# EAGLE design LPC824DIP (EAGLE 7.3.0)
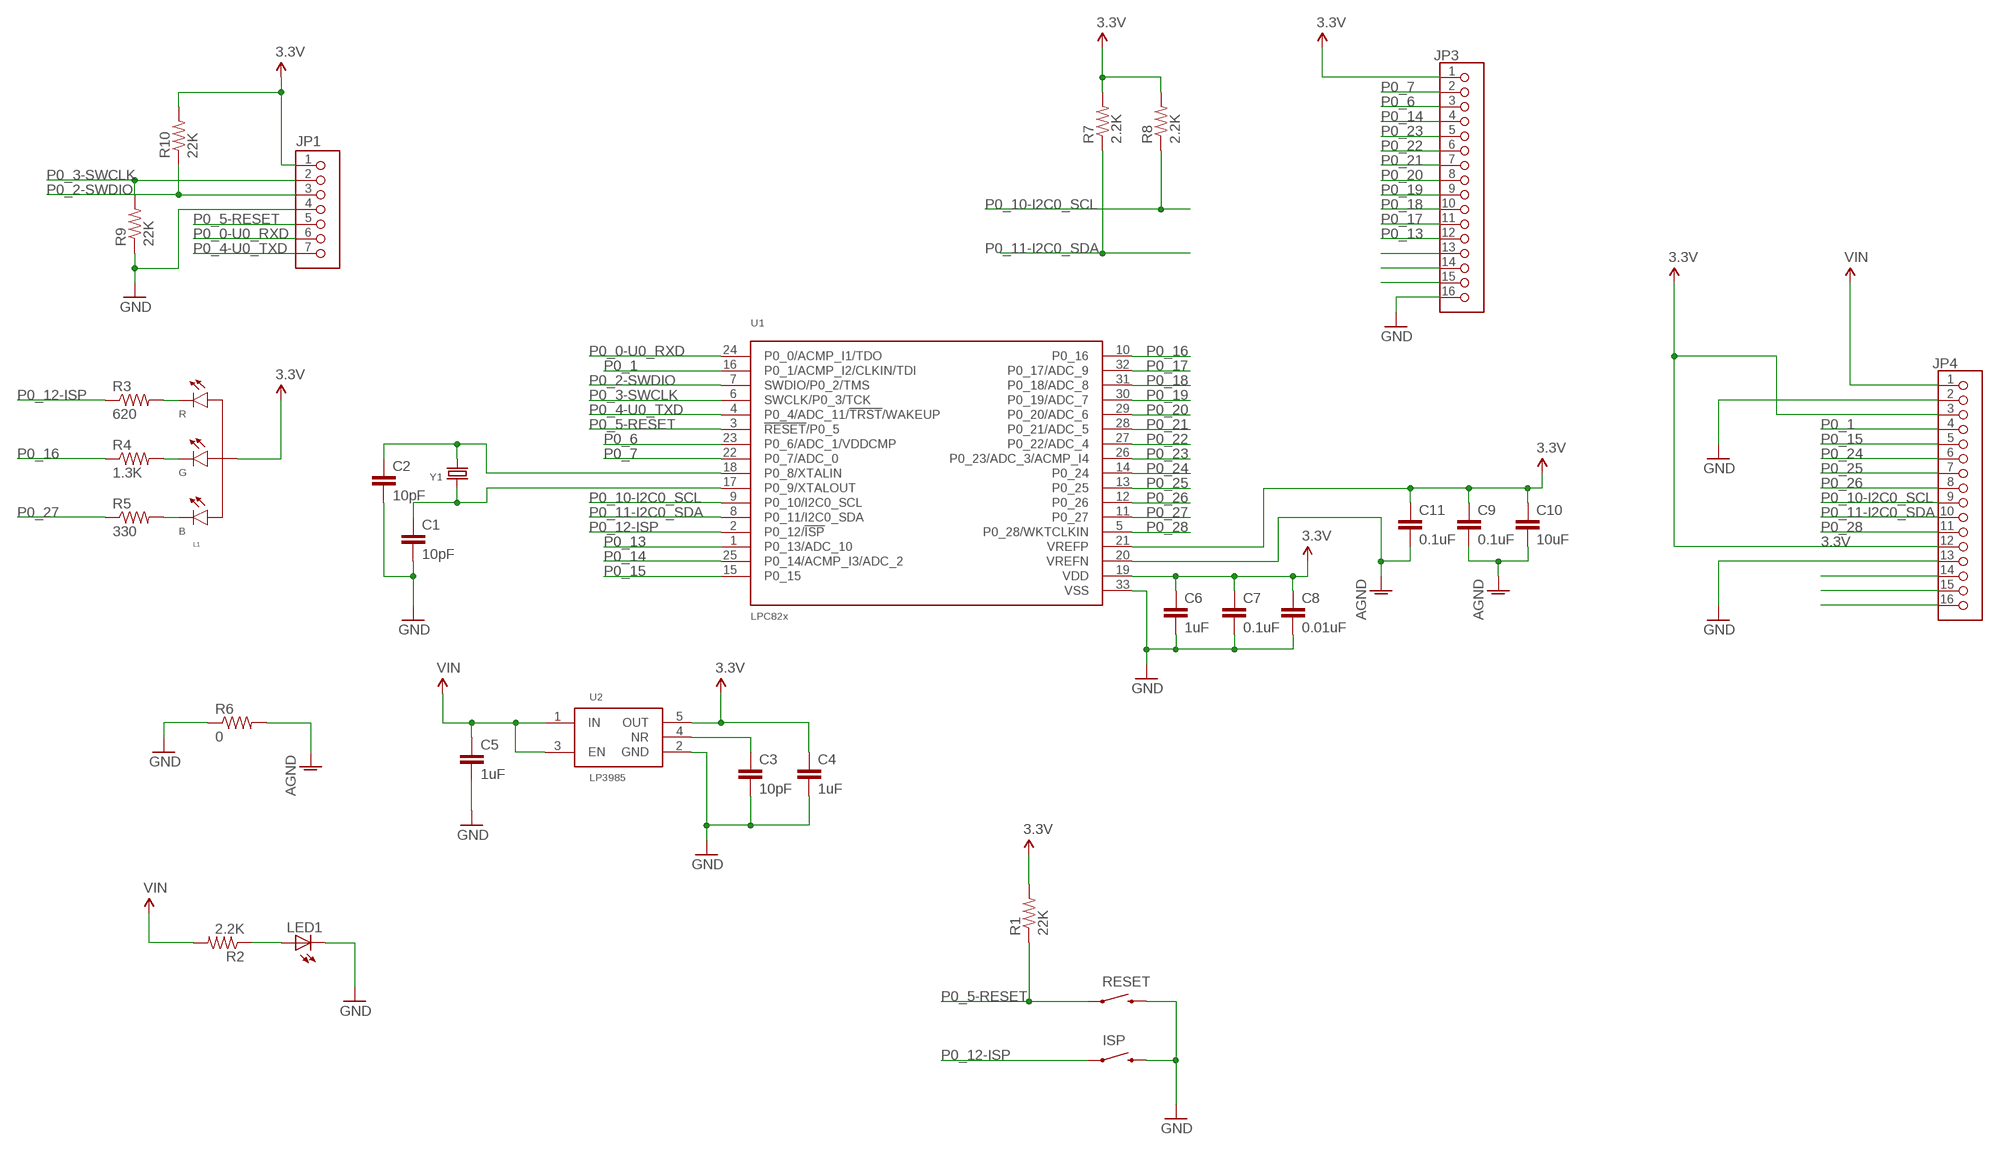
[diagram p0: schematic, sheet 1]

## Parts
C1  10pF  C0402  [C0402]
C2  10pF  C0402  [C0402]
C3  10pF  C0402  [C0402]
C4  1uF  C0402  [C0402]
C5  1uF  C0402  [C0402]
C6  1uF  C0402  [C0402]
C7  0.1uF  C0402  [C0402]
C8  0.01uF  C0402  [C0402]
C9  0.1uF  C0402  [C0402]
C10  10uF  C0402  [C0402]
C11  0.1uF  C0402  [C0402]
ISP  KMR221GLFS  [TACTILE_SWITCH_SMD-3]
JP1  HEADER_1X7_JST-SH_VERTICAL  [JST-SH_HEADER_VERTICAL_7]
JP3  HEADER_1X16  [HEADER_100MIL_1X16]
JP4  HEADER_1X16  [HEADER_100MIL_1X16]
L1  LED_RGB_CA-CLVBA-FKA  [P-LCC4-0]
LED1  LEDCHIPLED_0603  [CHIPLED_0603]
R1  22K  R0402  [R0402]
R2  2.2K  R0402  [R0402]
R3  620  R0402  [R0402]
R4  1.3K  R0402  [R0402]
R5  330  R0402  [R0402]
R6  0  R0402  [R0402]
R7  2.2K  R0402  [R0402]
R8  2.2K  R0402  [R0402]
R9  22K  R0402  [R0402]
R10  22K  R0402  [R0402]
RESET  KMR221GLFS  [TACTILE_SWITCH_SMD-3]
U1  LPC82XMX01JHI33  [QFN33]
U2  LP3985DBV  [SOT23]
Y1  CRYSTAL_3.2X2.5_4PAD  [CRYSTAL_SMD_3.2X2.5_4PAD]

## Nets
3.3V: C4.1 C6.1 C7.1 C8.1 C9.1 C10.1 C11.1 JP1.1 JP3.1 JP4.3 JP4.12 L1.2(A) R1.2 R7.2 R8.2 R10.2 U1.19(VDD) U1.21(VREFP) U2.5(OUT)
AGND: C9.2 C10.2 C11.2 R6.2 U1.20(VREFN)
GND: C1.2 C2.2 C3.2 C4.2 C5.2 C6.2 C7.2 C8.2 ISP.3 ISP.4 JP1.4 JP3.16 JP4.2 JP4.13 LED1.C R6.1 R9.1 RESET.3 RESET.4 U1.33(VSS) U2.2(GND)
N$1: C2.1 U1.18(P0_8/XTALIN) Y1.3
N$2: C1.1 U1.17(P0_9/XTALOUT) Y1.1
N$3: C3.1 U2.4(NR)
N$4: L1.1(RK) R3.2
N$15: LED1.A R2.1
N$23: L1.4(GK) R4.2
N$24: L1.3(BK) R5.2
P0_0-U0_RXD: JP1.6 JP3.14 U1.24(P0_0/ACMP_I1/TDO)
P0_1: JP4.4 U1.16(P0_1/ACMP_I2/CLKIN/TDI)
P0_2-SWDIO: JP1.3 R10.1 U1.7(SWDIO/P0_2/TMS)
P0_3-SWCLK: JP1.2 R9.2 U1.6(SWCLK/P0_3/TCK)
P0_4-U0_TXD: JP1.7 JP3.13 U1.4(P0_4/ADC_11/!TRST!/WAKEUP)
P0_5-RESET: JP1.5 JP4.14 R1.1 RESET.1 RESET.2 U1.3(!RESET!/P0_5)
P0_6: JP3.3 U1.23(P0_6/ADC_1/VDDCMP)
P0_7: JP3.2 U1.22(P0_7/ADC_0)
P0_10-I2C0_SCL: JP4.9 R8.1 U1.9(P0_10/I2C0_SCL)
P0_11-I2C0_SDA: JP4.10 R7.1 U1.8(P0_11/I2C0_SDA)
P0_12-ISP: ISP.1 ISP.2 JP3.15 R3.1 U1.2(P0_12/!ISP!)
P0_13: JP3.12 U1.1(P0_13/ADC_10)
P0_14: JP3.4 U1.25(P0_14/ACMP_I3/ADC_2)
P0_15: JP4.5 U1.15(P0_15)
P0_16: JP4.16 R4.1 U1.10(P0_16)
P0_17: JP3.11 U1.32(P0_17/ADC_9)
P0_18: JP3.10 U1.31(P0_18/ADC_8)
P0_19: JP3.9 U1.30(P0_19/ADC_7)
P0_20: JP3.8 U1.29(P0_20/ADC_6)
P0_21: JP3.7 U1.28(P0_21/ADC_5)
P0_22: JP3.6 U1.27(P0_22/ADC_4)
P0_23: JP3.5 U1.26(P0_23/ADC_3/ACMP_I4)
P0_24: JP4.6 U1.14(P0_24)
P0_25: JP4.7 U1.13(P0_25)
P0_26: JP4.8 U1.12(P0_26)
P0_27: JP4.15 R5.1 U1.11(P0_27)
P0_28: JP4.11 U1.5(P0_28/WKTCLKIN)
VIN: C5.1 JP4.1 R2.2 U2.1(IN) U2.3(EN)

## Library data of the parts
C1-C11 = heck:C
ISP RESET = heck:KMR221
JP1 = heck:HEADER_1X7
JP3 JP4 = heck:HEADER_1X16
L1 = heck:LED_RGB_CA: Cree: CLVBA-FKA
LED1 = adafruit:LED: LED OSRAM: - CHIPLED LG R971, LG N971, LY N971, LG Q971, LY Q971, LO R971, LY R971 LH N974, LH R974 LS Q976, LO Q976, LY Q976 LO Q996 - Hyper CHIPLED LW Q18S LB Q993, LB Q99A, LB R99A - SideLED LS A670, LO A670, LY A670, LG A670, LP A670 LB A673, LV A673, LT A673, LW A673 LH A674 LY A675 LS A676, LA A676, LO A676, LY A676, LW A676 LS A679, LY A679, LG A679 - Hyper Micro SIDELED® LS Y876, LA Y876, LO Y876, LY Y876 LT Y87S - SmartLED LW L88C, LW L88S LB L89C, LB L89S, LG L890 LS L89K, LO L89K, LY L89K LS L896, LA L896, LO L896, LY L896 - TOPLED LS T670, LO T670, LY T670, LG T670, LP T670 LSG T670, LSP T670, LSY T670, LOP T670, LYG T670 LG T671, LOG T671, LSG T671 LB T673, LV T673, LT T673, LW T673 LH T674 LS T676, LA T676, LO T676, LY T676, LB T676, LH T676, LSB T676, LW T676 LB T67C, LV T67C, LT T67C, LS T67K, LO T67K, LY T67K, LW E67C LS E67B, LA E67B, LO E67B, LY E67B, LB E67C, LV E67C, LT E67C LW T67C LS T679, LY T679, LG T679 LS T770, LO T770, LY T770, LG T770, LP T770 LB T773, LV T773, LT T773, LW T773 LH T774 LS E675, LA E675, LY E675, LS T675 LS T776, LA T776, LO T776, LY T776, LB T776 LHGB T686 LT T68C, LB T68C - Hyper Mini TOPLED® LB M676 - Mini TOPLED Santana® LG M470 LS M47K, LO M47K, LY M47K Source: http://www.osram.convergy.de/
R1-R10 = heck:R
U1 = heck:LPC82XMX01JHI33: LPC824M201JHI33 - 32KB flash, 8KB SRAM LPC822M101JHI33 - 16KB flash, 4KB SRAM
U2 = heck:LP3985: Ultra Low-Dropout CMOS Voltage regulator. 150mA Load, available in fixed voltages: 2.5-V, 2.6-V, 2.7-V, 2.8-V, 2.85-V, 2.9-V, 3-V, 3.1V, 3.2-V, 3.3-V, 4.7-V, 4.75-V, 4.8-V and 5-V
Y1 = heck:CRYSTAL

## Board
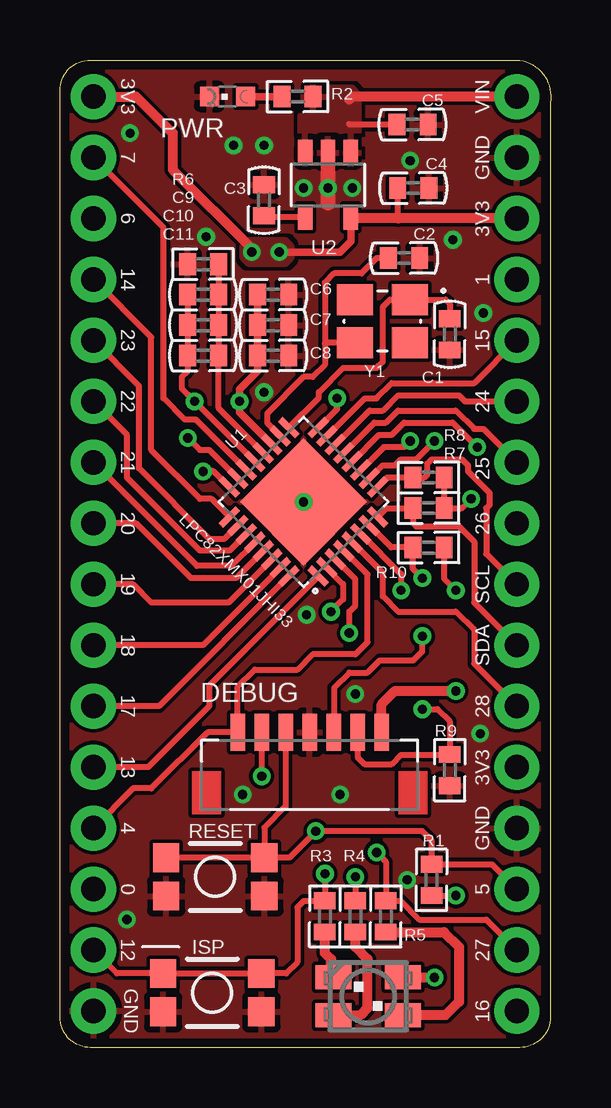
[diagram p1: board, top side]
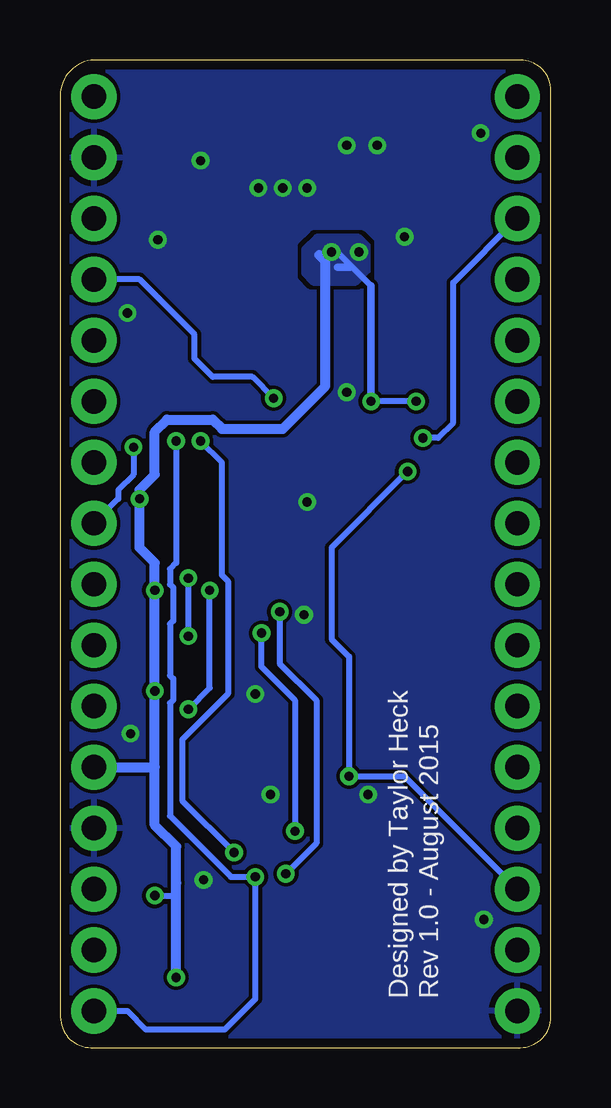
[diagram p2: board, bottom side, seen from below]

Size 20.47 x 41.15 mm. Coordinates in mm from the lower left corner, seen from the top.
Outline: 0,1.27 0,39.88 arc-90 1.27,41.15 19.18,41.15 arc-90 20.45,39.37 20.45,1.27 arc-90 19.18,0 1.27,0 arc-90 0,1.27
Copper layers (1*16): Top 0.0356mm / dielectric 1.5011mm / Bottom 0.0356mm
Design rules "heck *": minimum track width 6mil, minimum drill 13mil, track to track 6mil, track to pad 6mil, pad to pad 6mil, via to via 6mil, smd to smd 6mil, copper to edge 15mil, drill to drill 6mil, minimum pad ring 7mil, minimum via ring 7mil, stop-mask expansion 3mil, vias tented up to drill 20mil, thermal gap 10mil

### Footprints (pad centres in the part's own frame; a part is rotated, then mirrored left to right if it is on the bottom)
C0402 = smd 0.7 x 0.9: 1 -0.65,0; 2 0.65,0
TACTILE_SWITCH_SMD-3 = smd 1.1 x 1.2: 1 -2.05,0.8; 2 2.05,0.8; 3 -2.05,-0.8; 4 2.05,-0.8
JST-SH_HEADER_VERTICAL_7 = smd 0.6 x 1.55: 1 -3,-1.325; 2 -2,-1.325; 3 -1,-1.325; 4 0,-1.325; 5 1,-1.325; 6 2,-1.325; 7 3,-1.325
HEADER_100MIL_1X16 = drill 1.016 pad 1.88: 1 -19.05,0; 2 -16.51,0; 3 -13.97,0; 4 -11.43,0; 5 -8.89,0; 6 -6.35,0; 7 -3.81,0; 8 -1.27,0; 9 1.27,0; 10 3.81,0; 11 6.35,0; 12 8.89,0; 13 11.43,0; 14 13.97,0; 15 16.51,0; 16 19.05,0
P-LCC4-0 = smd 1 x 1.5: 1 -0.787,-1.45; 2 -0.787,1.45; 3 0.787,1.45; 4 0.787,-1.45
CHIPLED_0603 = smd 0.8 x 0.8: A 0,-0.75; C 0,0.75
R0402 = smd 0.7 x 0.9: 1 -0.65,0; 2 0.65,0
QFN33 = smd 1 x 0.27: 1 -2.625,1.75; 2 -2.625,1.25; 3 -2.625,0.75; 4 -2.625,0.25; 5 -2.625,-0.25; 6 -2.625,-0.75; 7 -2.625,-1.25; 8 -2.625,-1.75; 17 2.625,-1.75; 18 2.625,-1.25; 19 2.625,-0.75; 20 2.625,-0.25; 21 2.625,0.25; 22 2.625,0.75; 23 2.625,1.25; 24 2.625,1.75 | smd 0.27 x 1: 9 -1.75,-2.625; 10 -1.25,-2.625; 11 -0.75,-2.625; 12 -0.25,-2.625; 13 0.25,-2.625; 14 0.75,-2.625; 15 1.25,-2.625; 16 1.75,-2.625; 25 1.75,2.625; 26 1.25,2.625; 27 0.75,2.625; 28 0.25,2.625; 29 -0.25,2.625; 30 -0.75,2.625; 31 -1.25,2.625; 32 -1.75,2.625 | smd 3.75 x 3.75: 33 0,0
SOT23 = smd 0.6 x 1.05: 1 -0.95,-1.35; 2 0,-1.35; 3 0.95,-1.35; 4 0.95,1.35; 5 -0.95,1.35
CRYSTAL_SMD_3.2X2.5_4PAD = smd 1.5 x 1.3: 1 -1.15,-0.9; 2 1.15,-0.9; 3 1.15,0.9; 4 -1.15,0.9

### Placement (x,y rotation side)
C1  16.26,29.72 270 top
C2  14.35,32.89 0 top
C3  8.51,35.31 90 top
C4  14.73,35.81 0 top
C5  14.7,38.46 0 top
C6  8.89,31.37 0 top
C7  8.89,30.1 0 top
C8  8.89,28.83 0 top
C9  5.97,31.37 0 top
C10  5.97,30.1 0 top
C11  5.97,28.83 0 top
ISP  6.35,2.29 0 top
JP1  10.41,11.81 180 top
JP3  1.4,20.57 270 top
JP4  19.05,20.57 270 top
L1  12.85,2.13 270 top
LED1  6.99,39.62 90 top
R1  15.49,6.99 270 top
R2  9.91,39.62 0 top
R3  11.05,5.46 270 top
R4  12.32,5.46 270 top
R5  13.59,5.46 270 top
R6  5.97,32.64 0 top
R7  15.37,22.48 0 top
R8  15.37,23.75 0 top
R9  16.26,11.56 90 top
R10  15.37,20.83 0 top
RESET  6.48,7.11 0 top
U1  10.16,22.73 135 top
U2  11.18,35.94 180 top
Y1  13.45,30.26 180 top

### Tracks (layer width: path | path; a pad name or v marks a point on that pad's centre or on a via)
3.3V  (via drill 0.38)
  Top 0.254: C9.1 C10.1 C11.1 5.32,28.18 5.08,27.94 5.08,27.46 v5.61,26.92 | U1.21 v5.62,26.92 v5.61,26.92 | v5.61,26.92 5.32,27.22 | R8.2 R7.2 16.76,22.48 v17.14,22.86 | C4.1 14.08,34.61 | 14.08,34.61 14.1,34.59 | R1.2 v16.51,6.33 | R10.2 16.02,19.54 v16.51,19.05 | 14.08,34.61 14.08,34.56 14.1,34.54
  Top 0.305: U1.19 7.49,26.46 v7.49,26.92 7.49,27.43 8.24,28.18 C8.1 C7.1 C6.1 | U2.5 12.13,33.59 11.68,33.15 v9.14,33.15
  Top 0.406: L1.2 v15.62,2.92 | v15.62,2.92 | JP4.3 14.1,34.54 12.17,34.54 U2.5 | JP3.1 3.17,39.62 4.7,38.1 4.7,36.58 8,33.27 v8,33.15 | JP1.1 13.41,14.3 13.97,14.86 v16.51,14.86
  Bottom 0.254: v5.61,26.92 v7.49,26.92 | v16.51,6.33 15.62,6.33 15.62,6.86 | 7.49,31.75 8.89,33.15 v9.14,33.15
  Bottom 0.305: 8.89,32.51 8.38,32.51 | 7.49,31.75 v7.49,26.92
  Bottom 0.406: v15.62,2.92 15.62,6.86 15.62,8.38 16.51,9.27 16.51,11.68 | 16.51,11.68 v16.51,14.86 v16.51,19.05 16.51,20.19 17.14,20.83 v17.14,22.86 17.14,23.24 16.51,23.88 16.51,25.65 16,26.16 14.1,26.16 13.72,25.78 11.18,25.78 9.4,27.56 9.4,32.77 9.65,33.02 | JP4.12 16.51,11.68
  pour Bottom: 8,33.78 9.78,33.78 10.29,33.27 10.29,32.26 9.91,31.88 8.13,31.88 7.62,32.38 7.62,33.4
  pour Top: 7.87,33.66 9.4,33.66 9.65,33.4 9.65,32.89 9.4,32.64 7.87,32.64 7.62,32.89 7.62,33.4
AGND
  Top 0.254: U1.20 6.62,26.63 C11.2 C10.2 C9.2 R6.2
GND  (via drill 0.38)
  Top 0.61: U2.2 v11.18,35.81 11.18,35.18
  other vias: 10.16,22.73 17.65,30.61 6.1,33.78 8.51,37.59 14.61,36.96 16.38,33.66 17.53,13.08 7.62,10.54 11.68,10.54 10.29,18.03 7.24,37.59 2.92,38.1 12.19,35.81 10.16,35.81 8.51,27.3 14.48,6.99 2.79,5.33 12.32,14.73
  pour Top (rank 6): 20.7,41.02 20.32,-0.13 0,0 0,41.02
  pour Bottom (rank 6): 20.7,41.02 20.32,-0.13 -0.13,-0.25 0,41.02
N$1
  Top 0.254: Y1.3 11.07,29.36 11.05,29.34 | U1.18 8.64,26.02 8.64,26.42 10.16,27.94 10.54,27.94 11.05,28.45 11.05,29.34 | C2.1 13.21,32.89 12.57,32.26 11.43,32.26 11.05,31.88 11.05,29.34
N$2
  Top 0.254: C1.1 16.26,30.99 16.08,31.16 Y1.1 13.76,31.16 13.46,30.86 13.46,28.57 13.21,28.32 11.81,28.32 10.79,27.3 10.79,27.08 U1.17
N$3
  Top 0.254: U2.4 8.89,34.59 8.57,34.59 | 8.57,34.59 | C3.1 8.57,34.59
N$4
  Top 0.406: L1.1 11.3,3.02 11.3,3.68 11.05,3.94 R3.2
N$15
  Top 0.305: LED1.A R2.1
N$23
  Top 0.406: L1.4 12.52,1.35 12.83,1.65 12.83,3.68 12.32,4.19 R4.2
N$24
  Top 0.406: R5.2 16.02,4.81 16.64,4.19 16.64,1.91 16.08,1.35 L1.3
P0_0-U0_RXD  (via drill 0.38)
  Top 0.254: U1.24 6.42,24 v5.97,24 | JP1.6 v8.41,11.3
  Bottom 0.254: v5.97,24 9.14,20.83 9.14,17.02 8.41,16.29 v8.41,11.3 6.1,11.3 JP3.14
P0_1  (via drill 0.38)
  Top 0.254: U1.16 11.56,26.61 v11.56,27.05
  Bottom 0.254: JP4.4 17.14,32 14.86,29.72 14.86,28.7 14.1,27.94 12.45,27.94 v11.56,27.05
P0_2-SWDIO  (via drill 0.38)
  Top 0.254: U1.7 13.82,20.84 14.72,20.84 R10.1 14.72,19.95 v15.11,19.56 | JP1.3 11.43,13.15 11.43,14.99 12.06,15.62 12.83,15.62 13.34,16.13 14.73,16.13 15.11,16.51 v15.11,17.14
  Bottom 0.254: v15.11,17.14 v15.11,19.56
P0_3-SWCLK  (via drill 0.38)
  Top 0.254: U1.6 14.22,19.73 v14.22,19.05 | JP1.2 12.41,12.1 12.7,11.81 13.84,11.81 14.22,12.19 16.24,12.19 R9.2 16.26,13.59 15.75,14.1 v15.11,14.1
  Bottom 0.254: v15.11,14.1 14.22,14.99 v14.22,19.05
P0_4-U0_TXD
  Top 0.254: U1.4 12.83,19.71 12.83,16.89 12.32,16.38 10.54,16.38 9.91,15.75 8.13,15.75 7.41,15.03 JP1.7 6.15,13.14 3.81,10.79 3.05,10.79 JP3.13
P0_5-RESET  (via drill 0.38)
  Top 0.254: RESET.2 RESET.1 | v12.06,17.27 12.06,18.16 12.32,18.41 12.32,19.51 U1.3 | JP1.5 9.41,10.05 8.53,9.16 RESET.2 | RESET.2 9.56,7.91 v10.67,9.02 15.11,9.02 15.49,8.64 R1.1 18.02,7.63 JP4.14
  Bottom 0.254: v12.06,17.27 12.06,15.88 10.67,14.48 v10.67,9.02
P0_6  (via drill 0.38)
  Top 0.254: U1.23 6.23,24.89 5.84,24.89 v5.33,25.4
  Bottom 0.254: v5.33,25.4 4.7,25.4 4.06,26.04 4.06,31.88 JP3.3
P0_7
  Top 0.254: U1.22 5.67,26.16 5.21,26.16 4.32,27.05 4.32,34.16 JP3.2
P0_10-I2C0_SCL
  Top 0.254: JP4.9 17.78,20.57 17.78,22.48 17.91,22.61 17.91,23.11 17.02,24 17.02,24.26 16.76,24.51 15.49,24.51 15.32,24.33 15.32,23.88 15.19,23.75 R8.1 13.65,23.75 U1.9
P0_11-I2C0_SDA
  Top 0.254: U1.8 13.62,22.48 R7.1 14.72,21.86 14.86,21.72 16.64,21.72 17.27,21.08 17.27,18.54 JP4.10
P0_12-ISP  (via drill 0.38)
  Top 0.254: U1.2 11.81,19.31 11.81,18.67 v11.3,18.16 | v11.05,7.24 R3.1 10.18,6.11 9.91,5.84 9.91,3.56 9.44,3.09 ISP.2 ISP.1 2.38,3.09 JP3.15
  Bottom 0.254: v11.05,7.24 9.78,8.51 9.78,14.48 11.3,16 v11.3,18.16
P0_13
  Top 0.254: U1.1 6.22,15.08 6.22,14.22 3.68,11.68 JP3.12
P0_14
  Top 0.254: U1.25 6.32,22.86 5.84,22.86 3.81,24.89 3.81,29.59 JP3.4
P0_15
  Top 0.254: U1.15 12.71,27.05 13.21,27.05 13.84,27.69 17.27,27.69 JP4.5
P0_16  (via drill 0.38)
  Top 0.254: U1.10 13.45,24.26 13.97,24.26 14.22,24.51 14.86,24.51 v15.62,25.27 | v12.32,7.11 R4.1
  Bottom 0.254: v15.62,25.27 15.62,20.19 15.88,19.94 15.88,19.3 15.75,19.18 15.75,17.78 15.88,17.65 15.88,15.49 15.75,15.37 15.75,14.48 15.88,14.35 15.88,9.65 13.34,7.11 v12.32,7.11 12.32,2.03 13.59,0.76 16.89,0.76 17.65,1.52 JP4.16
P0_17
  Top 0.254: U1.32 4.13,14.22 JP3.11
P0_18
  Top 0.254: U1.31 5.96,16.76 JP3.10
P0_19
  Top 0.254: U1.30 7.03,18.54 3.81,18.54 3.05,19.3 JP3.9
P0_20
  Top 0.254: U1.29 7.34,19.56 5.46,19.56 3.17,21.84 JP3.8
P0_21
  Top 0.254: U1.28 7.14,20.07 5.71,20.07 JP3.7
P0_22
  Top 0.254: U1.27 7.07,20.7 5.84,20.7 2.79,23.75 2.79,25.53 JP3.6
P0_23
  Top 0.254: JP3.5 3.3,27.56 3.3,24.13 6.22,21.21 6.87,21.21 U1.26
P0_24
  Top 0.254: U1.14 12.91,26.54 13.46,26.54 14.1,27.18 16.64,27.18 16.89,26.92 JP4.6
P0_25
  Top 0.254: U1.13 13.11,26.04 13.59,26.04 14.1,26.54 16.51,26.54 17.27,25.78 17.65,25.78 JP4.7
P0_26  (via drill 0.38)
  Top 0.254: v17.4,25.02 16.38,26.04 14.35,26.04 13.84,25.53 13.31,25.53 U1.12
  Bottom 0.254: v17.4,25.02 17.4,23.88 18.03,23.24 18.03,22.86 JP4.8
P0_27  (via drill 0.38)
  Top 0.254: U1.11 13.51,25.02 14.35,25.02 v14.61,25.27 | v13.21,8.13 13.59,7.75 R5.1 14.21,6.11 14.99,5.33 17.78,5.33 JP4.15
  Bottom 0.254: v14.61,25.27 13.72,24.38 13.72,19.68 13.46,19.43 13.46,14.73 15.37,12.83 15.37,10.29 v13.21,8.13
P0_28
  Top 0.254: U1.5 13.46,19.79 13.46,18.8 14.1,18.16 16.51,18.16 17.27,17.4 17.27,16 JP4.11
VIN
  Top 0.254: C5.1 12.09,38.46 12.06,38.48
  Top 0.406: JP4.1 12.19,39.62 12.06,39.5
  pour Top (isolate 0.305): 10.16,40.01 12.19,40.01 12.45,39.75 12.45,36.96 12.32,36.83 10.16,36.83 10.03,36.96 10.03,38.86 10.16,38.99

### Text on the board
tNames: 3V3 | VIN | PWR | 7 | GND | 6 | 3V3 | 14 | 1 | 23 | 15 | 22 | 24 | 21 | 25 | 20 | 26 | 19 | SCL | 18 | SDA | 17 | DEBUG | 28 | 13 | 3V3 | 4 | GND | 0 | 5 | 12 | 27 | GND | 16
bNames: Rev 1.0 - August 2015 | Designed by Taylor Heck